# Altium schematic sheet NBT_Virtex_II_Pro_Rocket_IO.SchDoc
size D; Organization: Altium Limited; Address1: L3, 12a Rodborough Rd; Address2: Frenchs Forest; Address3: NSW; Address4: Australia 2086; DocumentNumber: 1; SheetNumber: 1; SheetTotal: 2
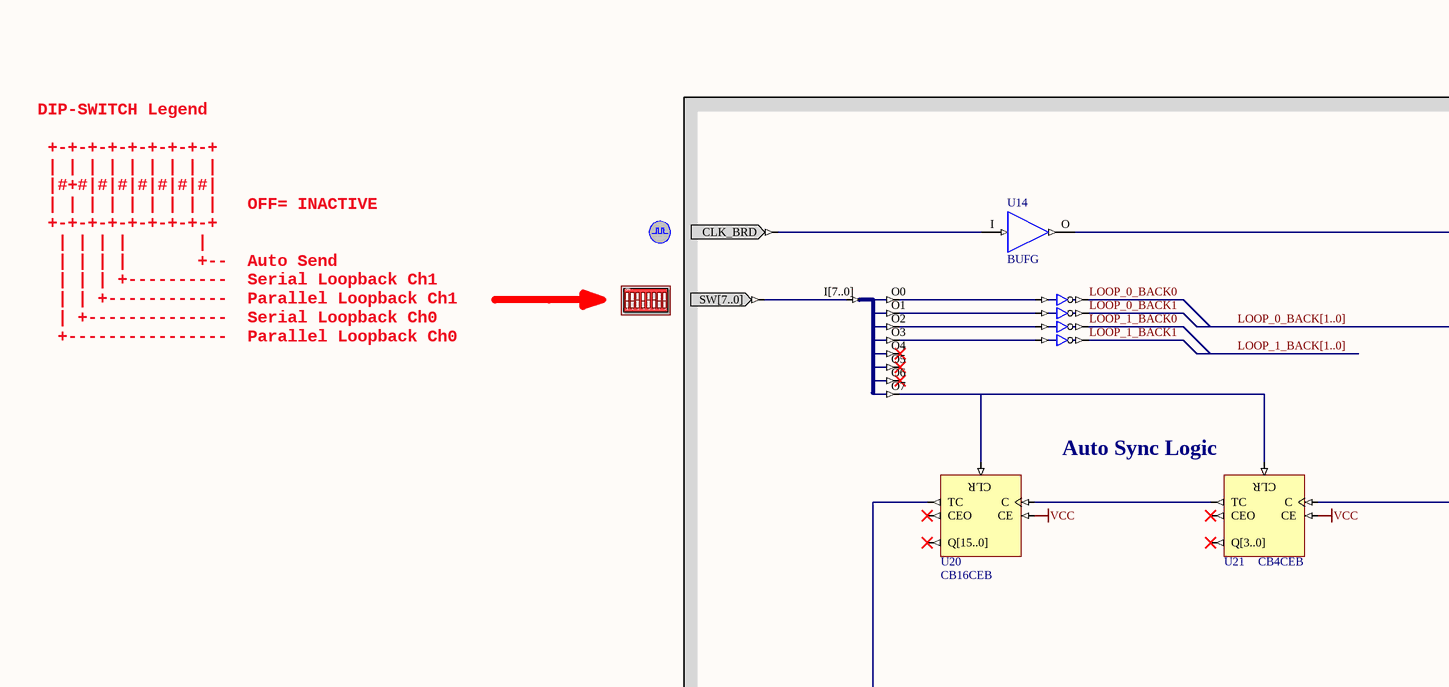
[diagram p0: NBT_Virtex_II_Pro_Rocket_IO.SchDoc, top left]
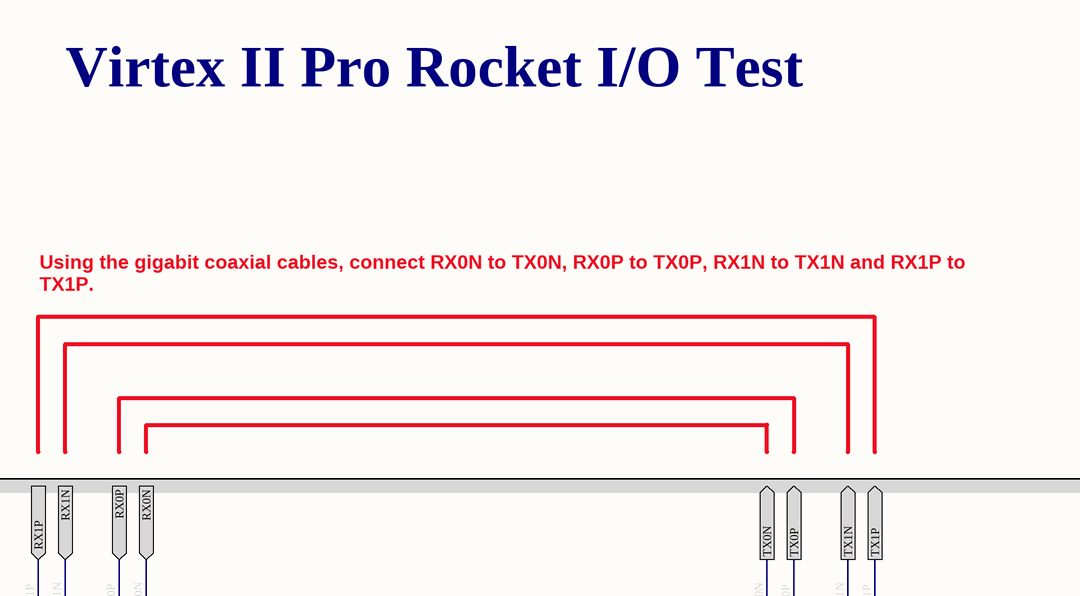
[diagram p1: NBT_Virtex_II_Pro_Rocket_IO.SchDoc, top right]
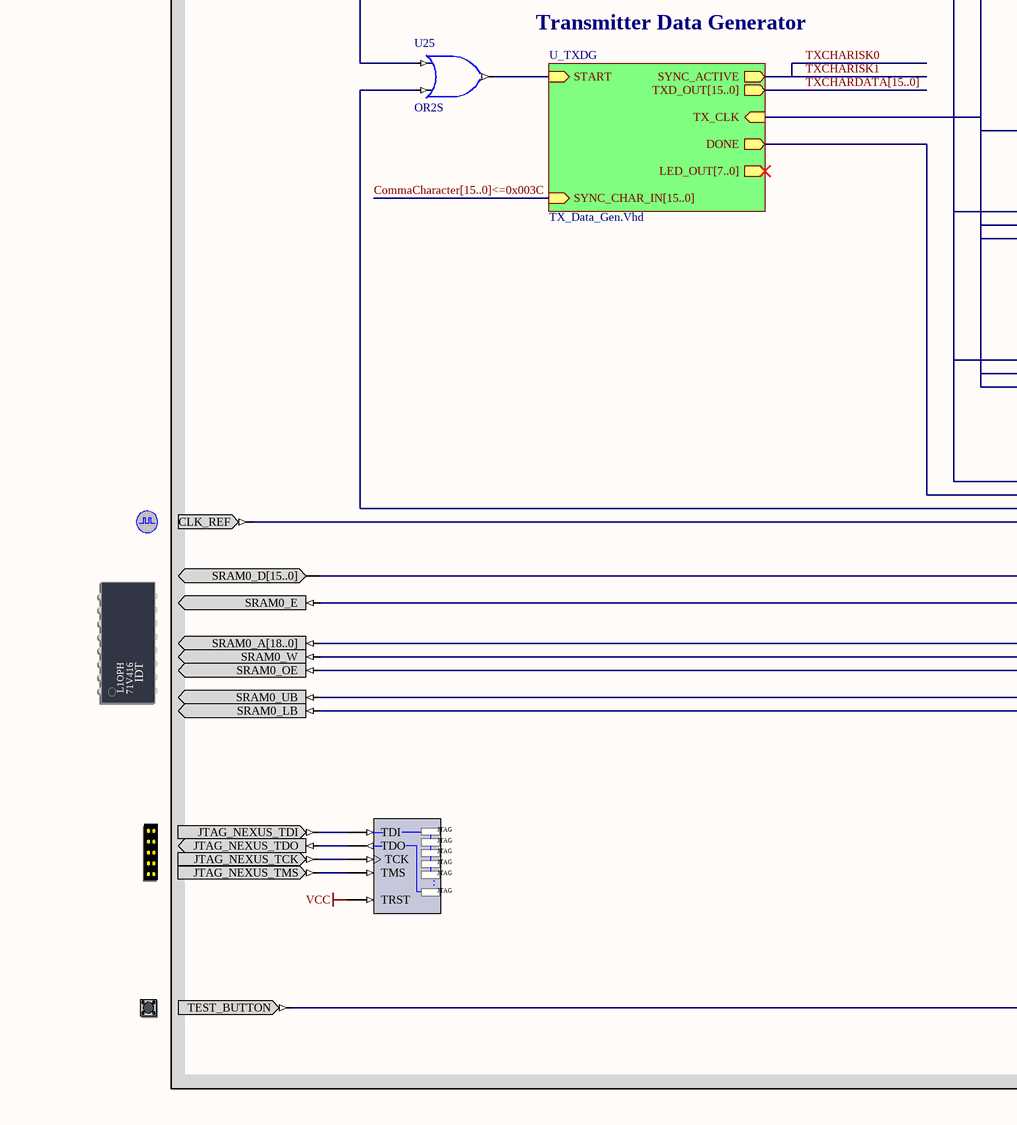
[diagram p2: NBT_Virtex_II_Pro_Rocket_IO.SchDoc, bottom left]
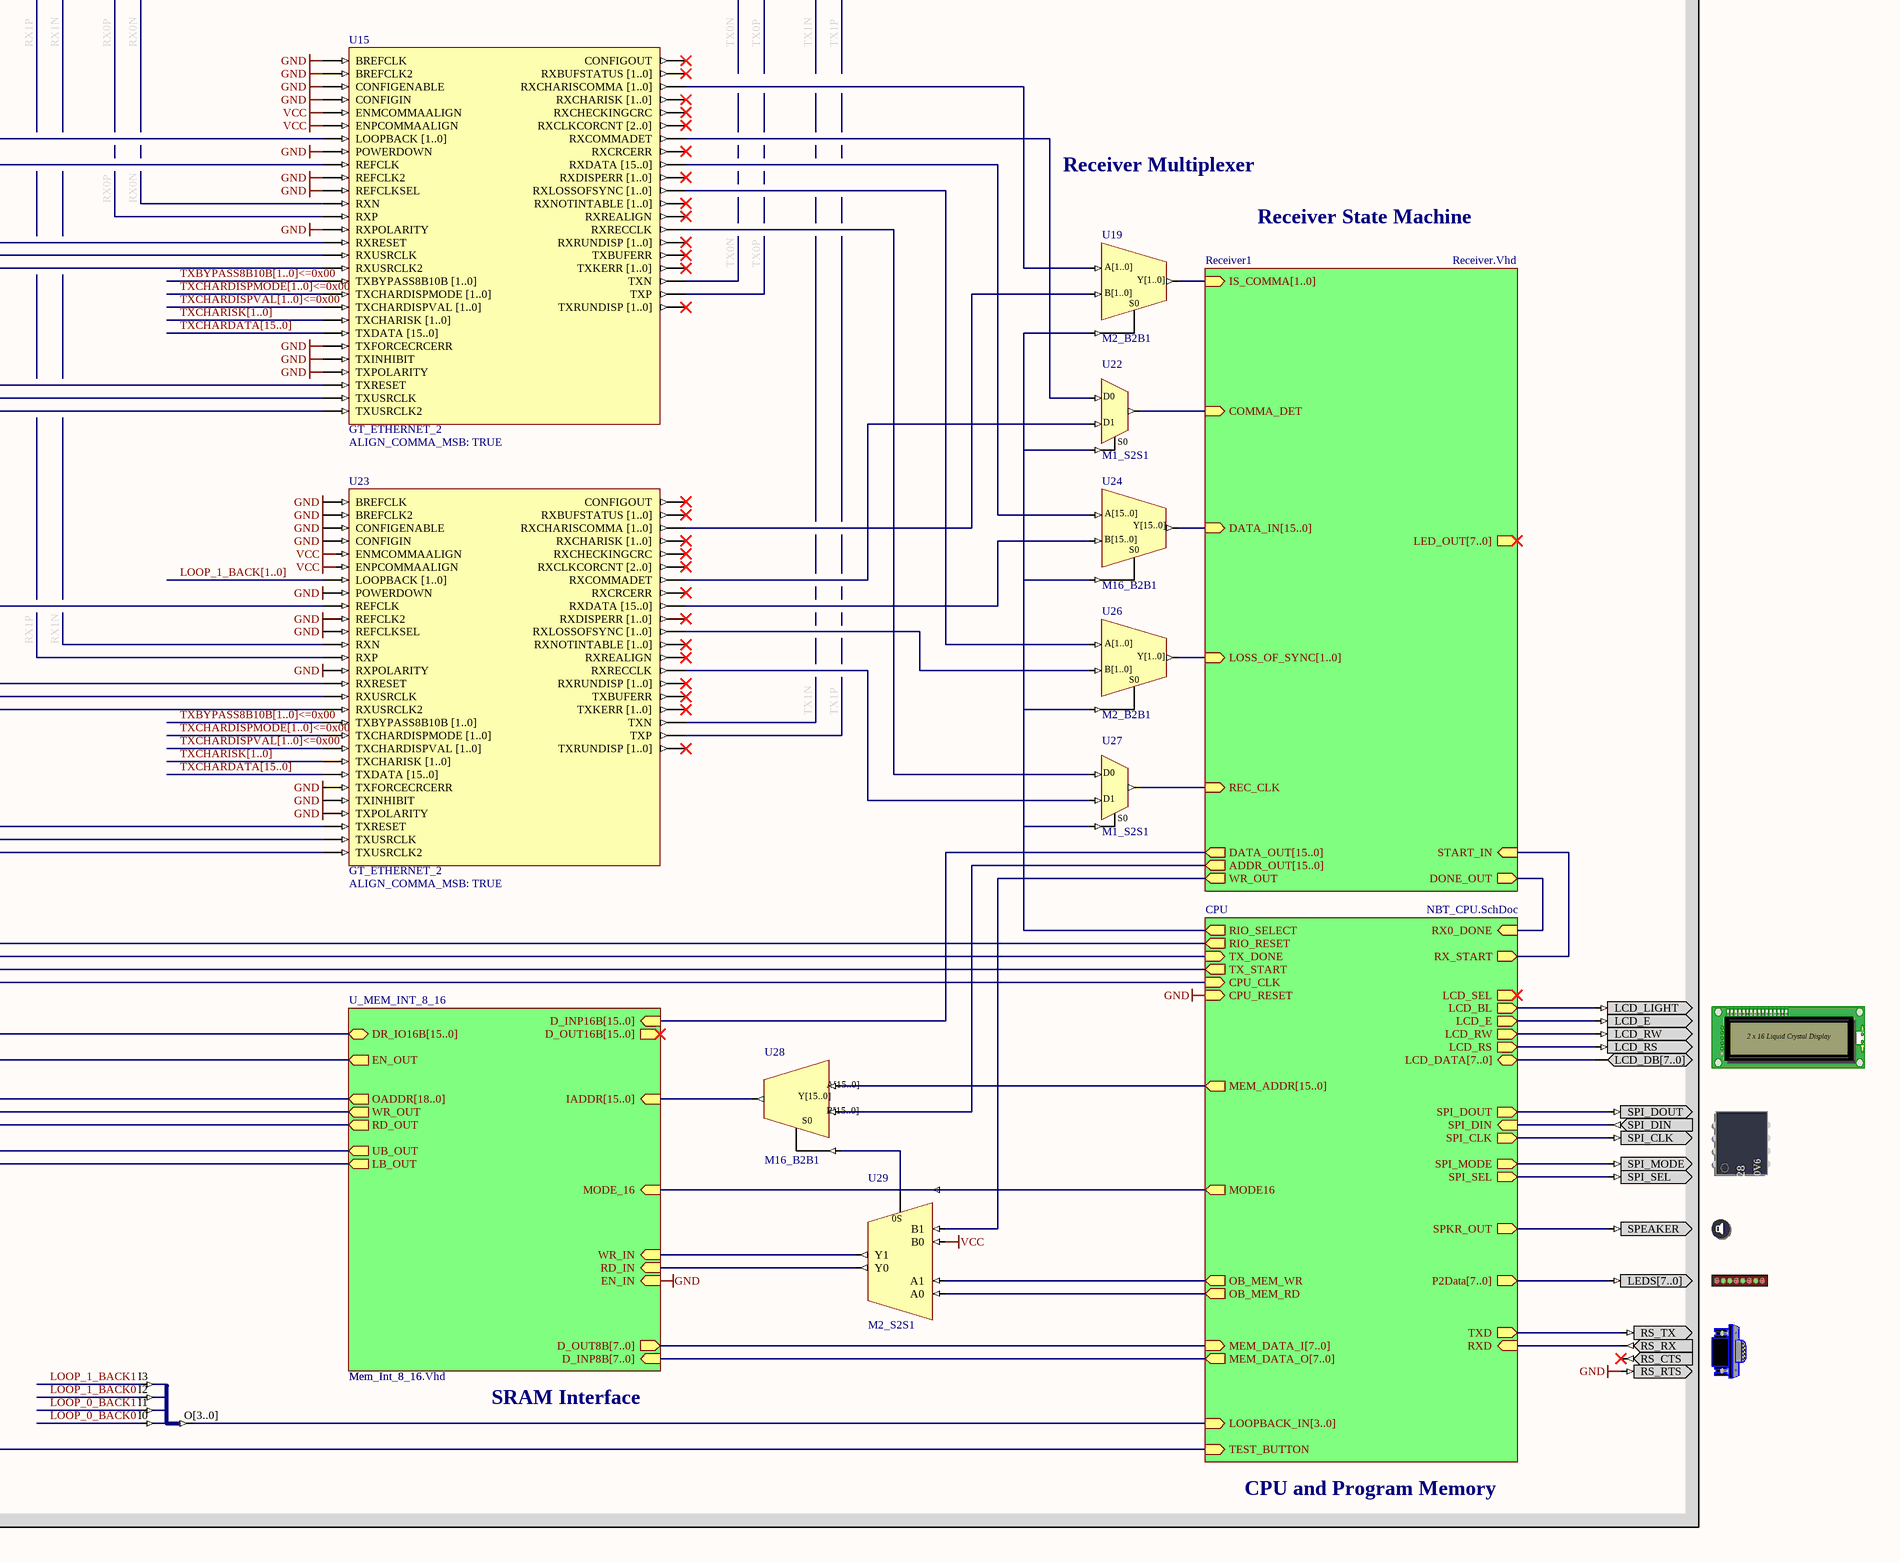
[diagram p3: NBT_Virtex_II_Pro_Rocket_IO.SchDoc, bottom right]

## Parts
(Parts that share a designator on the sheet are numbered #1, #2 ... from top to bottom, then left to right.)
?#1  CLOCK_BOARD  (value not drawn)
?#2  DIPSWITCH  (value not drawn)
?#3  CLOCK_REFERENCE  (value not drawn)
?#4  LCD  (value not drawn)
?#5  SRAM_DAUGHTER0  (value not drawn)
?#6  SERIALFMEMORY  (value not drawn)
?#7  SPEAKER  (value not drawn)
?#8  LED  (value not drawn)
?#9  NEXUS_JTAG_CONNECTOR  (value not drawn)
?#10  RS232CNTR  (value not drawn)
?#11  TEST_BUTTON  (value not drawn)
NEXUS_JTAG_PORT  NEXUS_JTAG_PORT  (value not drawn)
U14  BUFG
U15  GT_ETHERNET_2  ALIGN_COMMA_MSB: TRUE
U16  INV2S  (value not drawn)
U17  J8B_8S  (value not drawn)
U18  INV2S  (value not drawn)
U19  M2_B2B1
U20  CB16CEB
U21  CB4CEB
U22  M1_S2S1
U23  GT_ETHERNET_2  ALIGN_COMMA_MSB: TRUE
U24  M16_B2B1
U25  OR2S
U26  M2_B2B1
U27  M1_S2S1
U28  M16_B2B1
U29  M2_S2S1
U30  J4S_4B  (value not drawn)

## Sub-sheets
CPU = NBT_CPU.SchDoc: MEM_DATA_O[7..0] (out), CPU_CLK (in), CPU_RESET (in), MEM_DATA_I[7..0] (in), LCD_E (out), LCD_DATA[7..0] (bidir), LCD_RS (out), OB_MEM_WR (out), LCD_RW (out), MEM_ADDR[15..0] (out), OB_MEM_RD (out), LCD_BL (out), LCD_SEL (out), MODE16 (out), TX_START (out), TX_DONE (in), RX0_DONE (in), TEST_BUTTON (in), P2Data[7..0] (out), RXD (in), TXD (out), RX_START (out), RIO_SELECT (out), SPI_DOUT (out), SPI_DIN (in), SPI_CLK (out), SPI_MODE (out), SPI_SEL (out), SPKR_OUT (out), RIO_RESET (out), LOOPBACK_IN[3..0] (in)
Receiver1 = Receiver.Vhd: IS_COMMA[1..0] (in), DATA_IN[15..0] (in), LOSS_OF_SYNC[1..0] (in), COMMA_DET (in), LED_OUT[7..0] (out), DATA_OUT[15..0] (out), REC_CLK (in), ADDR_OUT[15..0] (out), WR_OUT (out), START_IN (in), DONE_OUT (out)
U_MEM_INT_8_16 = Mem_Int_8_16.Vhd: D_INP8B[7..0] (in), D_INP16B[15..0] (in), D_OUT8B[7..0] (out), D_OUT16B[15..0] (out), EN_IN (in), EN_OUT (out), IADDR[15..0] (in), LB_OUT (out), MODE_16 (in), OADDR[18..0] (out), RD_IN (in), RD_OUT (out), UB_OUT (out), WR_IN (in), WR_OUT (out), DR_IO16B[15..0] (bidir)  | VHDLENTITY: Mem_Int_8_16
U_TXDG = TX_Data_Gen.Vhd: TXD_OUT[15..0] (out), TX_CLK (in), SYNC_ACTIVE (out), SYNC_CHAR_IN[15..0] (in), START (in), LED_OUT[7..0] (out), DONE (out)

## Ports
RX0N (in), RX0P (in), RX1N (in), RX1P (in), TX0N (out), TX0P (out), TX1N (out), TX1P (out)

## Nets
GND: ?#10.RS_RTS U15.BREFCLK U15.BREFCLK2 U15.CONFIGENABLE U15.CONFIGIN U15.POWERDOWN U15.REFCLK2 U15.REFCLKSEL U15.RXPOLARITY U15.TXFORCECRCERR U15.TXINHIBIT U15.TXPOLARITY U23.BREFCLK U23.BREFCLK2 U23.CONFIGENABLE U23.CONFIGIN U23.POWERDOWN U23.REFCLK2 U23.REFCLKSEL U23.RXPOLARITY U23.TXFORCECRCERR U23.TXINHIBIT U23.TXPOLARITY ; sheet CPU/CPU_RESET, sheet U_MEM_INT_8_16/EN_IN
VCC: NEXUS_JTAG_PORT.TRST U15.ENMCOMMAALIGN U15.ENPCOMMAALIGN U20.CE U21.CE U23.ENMCOMMAALIGN U23.ENPCOMMAALIGN U29.B0
LOOP_0_BACK0: U16.O0 U30.I0
LOOP_0_BACK1: U16.O1 U30.I1
LOOP_0_BACK[1..0]: U15.LOOPBACK_[1..0]
LOOP_1_BACK0: U18.O0 U30.I2
LOOP_1_BACK1: U18.O1 U30.I3
LOOP_1_BACK[1..0]: U23.LOOPBACK_[1..0]
RX0N: U15.RXN ; port RX0N
RX0P: U15.RXP ; port RX0P
RX1N: U23.RXN ; port RX1N
RX1P: U23.RXP ; port RX1P
TX0N: U15.TXN ; port TX0N
TX0P: U15.TXP ; port TX0P
TX1N: U23.TXN ; port TX1N
TX1P: U23.TXP ; port TX1P
TXBYPASS8B10B[1..0]<=0x00: U15.TXBYPASS8B10B_[1..0] U23.TXBYPASS8B10B_[1..0]
TXCHARDATA[15..0]: U15.TXDATA_[15..0] U23.TXDATA_[15..0] ; sheet U_TXDG/TXD_OUT[15..0]
TXCHARDISPMODE[1..0]<=0x00: U15.TXCHARDISPMODE_[1..0] U23.TXCHARDISPMODE_[1..0]
TXCHARDISPVAL[1..0]<=0x00: U15.TXCHARDISPVAL_[1..0] U23.TXCHARDISPVAL_[1..0]
TXCHARISK0: sheet U_TXDG/SYNC_ACTIVE  [also labelled TXCHARISK1]
TXCHARISK[1..0]: U15.TXCHARISK_[1..0] U23.TXCHARISK_[1..0]
Net?#1_CLK_BRD: ?#1.CLK_BRD U14.I
Net?#2_SW[7..0]: ?#2.SW[7..0] U17.I[7..0]
Net?#3_CLK_REF: ?#3.CLK_REF ; sheet CPU/CPU_CLK
Net?#4_LCD_DB[7..0]: ?#4.LCD_DB[7..0] ; sheet CPU/LCD_DATA[7..0]
Net?#4_LCD_E: ?#4.LCD_E ; sheet CPU/LCD_E
Net?#4_LCD_LIGHT: ?#4.LCD_LIGHT ; sheet CPU/LCD_BL
Net?#4_LCD_RS: ?#4.LCD_RS ; sheet CPU/LCD_RS
Net?#4_LCD_RW: ?#4.LCD_RW ; sheet CPU/LCD_RW
Net?#5_SRAM0_A[18..0]: ?#5.SRAM0_A[18..0] ; sheet U_MEM_INT_8_16/OADDR[18..0]
Net?#5_SRAM0_D[15..0]: ?#5.SRAM0_D[15..0] ; sheet U_MEM_INT_8_16/DR_IO16B[15..0]
Net?#5_SRAM0_E: ?#5.SRAM0_E ; sheet U_MEM_INT_8_16/EN_OUT
Net?#5_SRAM0_LB: ?#5.SRAM0_LB ; sheet U_MEM_INT_8_16/LB_OUT
Net?#5_SRAM0_OE: ?#5.SRAM0_OE ; sheet U_MEM_INT_8_16/RD_OUT
Net?#5_SRAM0_UB: ?#5.SRAM0_UB ; sheet U_MEM_INT_8_16/UB_OUT
Net?#5_SRAM0_W: ?#5.SRAM0_W ; sheet U_MEM_INT_8_16/WR_OUT
Net?#6_SPI_CLK: ?#6.SPI_CLK ; sheet CPU/SPI_CLK
Net?#6_SPI_DIN: ?#6.SPI_DIN ; sheet CPU/SPI_DIN
Net?#6_SPI_DOUT: ?#6.SPI_DOUT ; sheet CPU/SPI_DOUT
Net?#6_SPI_MODE: ?#6.SPI_MODE ; sheet CPU/SPI_MODE
Net?#6_SPI_SEL: ?#6.SPI_SEL ; sheet CPU/SPI_SEL
Net?#7_SPEAKER: ?#7.SPEAKER ; sheet CPU/SPKR_OUT
Net?#8_LEDS[7..0]: ?#8.LEDS[7..0] ; sheet CPU/P2Data[7..0]
Net?#9_JTAG_NEXUS_TCK: ?#9.JTAG_NEXUS_TCK NEXUS_JTAG_PORT.TCK
Net?#9_JTAG_NEXUS_TDI: ?#9.JTAG_NEXUS_TDI NEXUS_JTAG_PORT.TDI
Net?#9_JTAG_NEXUS_TDO: ?#9.JTAG_NEXUS_TDO NEXUS_JTAG_PORT.TDO
Net?#9_JTAG_NEXUS_TMS: ?#9.JTAG_NEXUS_TMS NEXUS_JTAG_PORT.TMS
Net?#10_RS_RX: ?#10.RS_RX ; sheet CPU/RXD
Net?#10_RS_TX: ?#10.RS_TX ; sheet CPU/TXD
Net?#11_TEST_BUTTON: ?#11.TEST_BUTTON ; sheet CPU/TEST_BUTTON
NetU14_O: U14.O U15.REFCLK U15.RXUSRCLK U15.RXUSRCLK2 U15.TXUSRCLK U15.TXUSRCLK2 U21.C U23.REFCLK U23.RXUSRCLK U23.RXUSRCLK2 U23.TXUSRCLK U23.TXUSRCLK2 ; sheet U_TXDG/TX_CLK
NetU15_RXCHARISCOMMA [1..0]: U15.RXCHARISCOMMA_[1..0] U19.A[1..0]
NetU15_RXCOMMADET: U15.RXCOMMADET U22.D0
NetU15_RXDATA [15..0]: U15.RXDATA_[15..0] U24.A[15..0]
NetU15_RXLOSSOFSYNC [1..0]: U15.RXLOSSOFSYNC_[1..0] U26.A[1..0]
NetU15_RXRECCLK: U15.RXRECCLK U27.D0
NetU15_RXRESET: U15.RXRESET U15.TXRESET U23.RXRESET U23.TXRESET ; sheet CPU/RIO_RESET
NetU16_I0: U16.I0 U17.O0
NetU16_I1: U16.I1 U17.O1
NetU17_O2: U17.O2 U18.I0
NetU17_O3: U17.O3 U18.I1
NetU17_O7: U17.O7 U20.CLR U21.CLR
NetU19_B[1..0]: U19.B[1..0] U23.RXCHARISCOMMA_[1..0]
NetU19_S0: U19.S0 U22.S0 U24.S0 U26.S0 U27.S0 ; sheet CPU/RIO_SELECT
NetU19_Y[1..0]: U19.Y[1..0] ; sheet Receiver1/IS_COMMA[1..0]
NetU20_C: U20.C U21.TC
NetU20_TC: U20.TC U25.I0
NetU22_D1: U22.D1 U23.RXCOMMADET
NetU22_O: U22.O ; sheet Receiver1/COMMA_DET
NetU23_RXDATA [15..0]: U23.RXDATA_[15..0] U24.B[15..0]
NetU23_RXLOSSOFSYNC [1..0]: U23.RXLOSSOFSYNC_[1..0] U26.B[1..0]
NetU23_RXRECCLK: U23.RXRECCLK U27.D1
NetU24_Y[15..0]: U24.Y[15..0] ; sheet Receiver1/DATA_IN[15..0]
NetU25_I1: U25.I1 ; sheet CPU/TX_START
NetU25_O: U25.O ; sheet U_TXDG/START
NetU26_Y[1..0]: U26.Y[1..0] ; sheet Receiver1/LOSS_OF_SYNC[1..0]
NetU27_O: U27.O ; sheet Receiver1/REC_CLK
NetU28_A[15..0]: U28.A[15..0] ; sheet CPU/MEM_ADDR[15..0]
NetU28_B[15..0]: U28.B[15..0] ; sheet Receiver1/ADDR_OUT[15..0]
NetU28_S0: U28.S0 U29.S0 ; sheet CPU/MODE16, sheet U_MEM_INT_8_16/MODE_16
NetU28_Y[15..0]: U28.Y[15..0] ; sheet U_MEM_INT_8_16/IADDR[15..0]
NetU29_A0: U29.A0 ; sheet CPU/OB_MEM_RD
NetU29_A1: U29.A1 ; sheet CPU/OB_MEM_WR
NetU29_B1: U29.B1 ; sheet Receiver1/WR_OUT
NetU29_Y0: U29.Y0 ; sheet U_MEM_INT_8_16/RD_IN
NetU29_Y1: U29.Y1 ; sheet U_MEM_INT_8_16/WR_IN
NetU30_O[3..0]: U30.O[3..0] ; sheet CPU/LOOPBACK_IN[3..0]
(unnamed): sheet CPU/TX_DONE, sheet U_TXDG/DONE
(unnamed): sheet CPU/RX0_DONE, sheet Receiver1/DONE_OUT
(unnamed): sheet CPU/RX_START, sheet Receiver1/START_IN

Not connected (* = marked no-connect by the designer): ?#10 RS_CTS*; U15 CONFIGOUT* RXBUFSTATUS [1..0]* RXCHARISK [1..0]* RXCHECKINGCRC* RXCLKCORCNT [2..0]* RXCRCERR* RXDISPERR [1..0]* RXNOTINTABLE [1..0]* RXREALIGN* RXRUNDISP [1..0]* TXBUFERR* TXKERR [1..0]* TXRUNDISP [1..0]*; U17 O4* O5* O6*; U20 CEO* Q[15..0]*; U21 CEO* Q[3..0]*; U23 CONFIGOUT* RXBUFSTATUS [1..0]* RXCHARISK [1..0]* RXCHECKINGCRC* RXCLKCORCNT [2..0]* RXCRCERR* RXDISPERR [1..0]* RXNOTINTABLE [1..0]* RXREALIGN* RXRUNDISP [1..0]* TXBUFERR* TXKERR [1..0]* TXRUNDISP [1..0]*

## Buses and harness runs
bus CommaCharacter[15..0]<=0x003C = sheet U_TXDG/SYNC_CHAR_IN[15..0]
bus LOOP_0_BACK[1..0]
bus LOOP_1_BACK[1..0]
bus sheet CPU/MEM_DATA_I[7..0] = sheet U_MEM_INT_8_16/D_OUT8B[7..0]
bus sheet CPU/MEM_DATA_O[7..0] = sheet U_MEM_INT_8_16/D_INP8B[7..0]
bus sheet Receiver1/DATA_OUT[15..0] = sheet U_MEM_INT_8_16/D_INP16B[15..0]
bus TXBYPASS8B10B[1..0]<=0x00
bus TXCHARDATA[15..0]
bus TXCHARDATA[15..0] = sheet U_TXDG/TXD_OUT[15..0]
bus TXCHARDISPMODE[1..0]<=0x00
bus TXCHARDISPVAL[1..0]<=0x00
bus TXCHARISK[1..0]

## Notes on the sheet
- Virtex II Pro Rocket I/O Test
- Using the gigabit coaxial cables, connect RX0N to TX0N, RX0P to TX0P, RX1N to TX1N and RX1P to TX1P.
- Receiver Multiplexer
- (near U21) Auto Sync Logic
- Receiver State Machine
- DIP-SWITCH Legend
  +-+-+-+-+-+-+-+-+
  | | | | | | | | |
  |#+#|#|#|#|#|#|#|
  | | | | | | | | |   OFF= INACTIVE
  +-+-+-+-+-+-+-+-+
  | | | |       |
  | | | |       +--  Auto Send
  | | | +----------  Serial Loopback Ch1
  | | +------------  Parallel Loopback Ch1
  | +--------------  Serial Loopback Ch0
  +----------------  Parallel Loopback Ch0
- Transmitter Data Generator
- SRAM Interface
- CPU and Program Memory
- Title
- Size:
- Date:
- File:
- D
- Number:
- Time:
- Revision:
- Sheet
- of
- (in symbol DIPSWITCH) ON; 1; 2; 3; 4; 5; 6; 7; 8
- (in symbol LCD) 2 x 16 Liquid Crystal Display
- (in symbol NEXUS_JTAG_PORT) JTAG; .
- (in symbol SERIALFMEMORY) 2SP40V6; ST 93228
- (in symbol SRAM_DAUGHTER0) L1OPH; 71V416; IDT

## Library data of the parts
?#1 = CLOCK_BOARD: Global System Clock Supply; PortComponent: True; Published: 19-Nov-2003; Publisher: Altium Limited; HelpURL: TR0102 NanoBoard Technical Reference Manual - NB1.pdf#page=29
?#2 = DIPSWITCH: 8-Way Dip Switch; PortComponent: True; Published: 19-Nov-2003; Publisher: Altium Limited
?#3 = CLOCK_REFERENCE: Global System Clock Reference Supply; PortComponent: True; Published: 19-Nov-2003; Publisher: Altium Limited; HelpURL: TR0102 NanoBoard Technical Reference Manual - NB1.pdf#page=29
?#4 = LCD: Liquid Crystal Display; PortComponent: True; Published: 19-Nov-2003; Publisher: Altium Limited
?#5 = SRAM_DAUGHTER0: SRAM - 0 Module - Daughterboard; PortComponent: True; Published: 13-May-2004; Publisher: Altium Limited
?#6 = SERIALFMEMORY: Serial Flash Memory; PortComponent: True; Published: 19-Nov-2003; Publisher: Altium Limited
?#7 = SPEAKER: Sound interface; PortComponent: True; Published: 19-Nov-2003; Publisher: Altium Limited
?#8 = LED: 8-Way LEDS; PortComponent: True; Published: 19-Nov-2003; Publisher: Altium Limited
?#9 = NEXUS_JTAG_CONNECTOR: JTAG Port; PortComponent: True; Published: 19-Nov-2003; Publisher: Altium Limited
?#10 = RS232CNTR: DCE Serial Port Connector; PortComponent: True; Published: 19-Nov-2003; Publisher: Altium Limited
?#11 = TEST_BUTTON: Test Button; PortComponent: True; Published: 19-Nov-2003; Publisher: Altium Limited
NEXUS_JTAG_PORT = NEXUS_JTAG_PORT: Soft Nexus-Chain Connector; NEXUS_JTAG_CONNECTOR: True; Published: 18-Dec-2003; Publisher: Altium Limited
U14 = BUFG: Global Clock Buffer; FPGAVendor: Xilinx; Published: 7-3-2002; Revision: 9/15/2003; Datasheet: Latest Revision: 1999; Publisher: Altium Hobart Technology Centre
U15 U23 = GT_ETHERNET_2: Gigabit Transceiver for High-Speed I/O; FPGAVendor: Xilinx; Note: Supported for Virtex-II Pro but not for Virtex-II or Virtex-II Pro X.; Published: 7-3-2002; Revision: 9/15/2003; Datasheet: Latest Revision: 2002; Publisher: Altium Hobart Technology Centre
U16 U18 = INV2S: 2-Bit Inverter, Single Pin Version; Xilinx Equivalent: INV2; ArchiveName: GENERIC; VHDLIB_SIM: GENERIC_LIB; Published: 29-Jan-2004; Publisher: Altium Limited; Core Revision: 1.00.00
U17 = J8B_8S: 8-Bit input bus to 8 single pin outputs; ArchiveName: GENERIC; VHDLIB_SIM: GENERIC_LIB; Published: 29-Jan-2004; Publisher: Altium Limited; Core Revision: 1.00.00
U19 U26 = M2_B2B1: 2x2-Bit Bus to 1x2-Bit Bus Multiplexer; ArchiveName: GENERIC; VHDLIB_SIM: GENERIC_LIB; Published: 29-Jan-2004; Publisher: Altium Limited; Core Revision: 1.00.00
U20 = CB16CEB: 16-Bit Cascadable Binary Counters with Clock Enable and Asynchronous Clear, Bus Version; Xilinx Equivalent: CB16CE; ArchiveName: GENERIC; VHDLIB_SIM: GENERIC_LIB; Published: 29-Jan-2004; Publisher: Altium Limited; Core Revision: 1.00.00
U21 = CB4CEB: 4-Bit Cascadable Binary Counters with Clock Enable and Asynchronous Clear, Bus Version; ArchiveName: GENERIC; VHDLIB_SIM: GENERIC_LIB; Published: 29-Jan-2004; Publisher: Altium Limited; Core Revision: 1.00.00
U22 U27 = M1_S2S1: 2x1-Single Wire to 1x1-Single Wire Multiplexer; Xilinx Equivalent: M2_1; ArchiveName: GENERIC; VHDLIB_SIM: GENERIC_LIB; Published: 29-Jan-2004; Publisher: Altium Limited; Core Revision: 1.00.00
U24 U28 = M16_B2B1: 2x16-Bit Bus to 1x16-Bit Bus Multiplexer; ArchiveName: GENERIC; VHDLIB_SIM: GENERIC_LIB; Published: 29-Jan-2004; Publisher: Altium Limited; Core Revision: 1.00.00
U25 = OR2S: 2-Input OR Gate, Single Pin Version; Xilinx Equivalent: OR2; ArchiveName: GENERIC; VHDLIB_SIM: GENERIC_LIB; Published: 29-Jan-2004; Publisher: Altium Limited; Core Revision: 1.00.00
U29 = M2_S2S1: 2x2-Single Wire to 1x2-Single Wire Multiplexer; ArchiveName: GENERIC; VHDLIB_SIM: GENERIC_LIB; Published: 29-Jan-2004; Publisher: Altium Limited; Core Revision: 1.00.00
U30 = J4S_4B: 4 Single pin inputs to single 4-Bit output bus; ArchiveName: GENERIC; VHDLIB_SIM: GENERIC_LIB; Published: 29-Jan-2004; Publisher: Altium Limited; Core Revision: 1.00.00